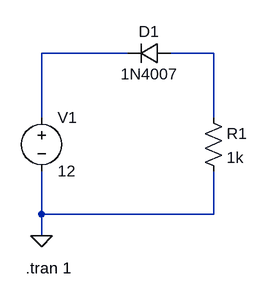
[diagram p0: schematic protection_design.asc]
protection_design.asc, the LTspice schematic file:
Version 4.1
SHEET 1 880 680
WIRE 208 32 80 32
WIRE 336 32 272 32
WIRE 80 128 80 32
WIRE 336 128 336 32
WIRE 80 272 80 208
WIRE 336 272 336 208
WIRE 336 272 80 272
WIRE 80 304 80 272
FLAG 80 304 0
SYMBOL voltage 80 112 R0
SYMATTR InstName V1
SYMATTR Value 12
SYMBOL res 320 112 R0
SYMATTR InstName R1
SYMATTR Value 1k
SYMBOL diode 272 16 R90
WINDOW 0 0 32 VBottom 2
WINDOW 3 32 32 VTop 2
SYMATTR InstName D1
SYMATTR Value 1N4007
TEXT 56 352 Left 2 !.tran 1

The netlist it stands for:
* protection_design.asc
V1 N001 0 12
R1 N002 0 1k
D1 N002 N001 1N4007
.model D D
.lib standard.dio
.tran 1
.backanno
.end